# Altium schematic sheet Supplies.SchDoc
size A4; SheetNumber: 9; SheetTotal: 10; SPICEModelCacheEZLPWFQN: <root> / <DocumentId>EZLPWFQN</DocumentId> / <CacheFrame Number="0"> / <Model Name="1n4001" Kind="MDL"> / <Text>*1N4001 MCE 8-16-95 / *50V 1A Si GenPurpose Diode pkg:DIODE0.4 1,2 / .MODEL 1N4001 D(IS=2.55E-9 RS=0.042 N=1.75 TT=5.76E-6 CJO=1.85E-11 / + VJ=0.75 M=0.333 BV=50 IBV=1E-5 )</Text> / </Model> / </CacheFrame> / </root>
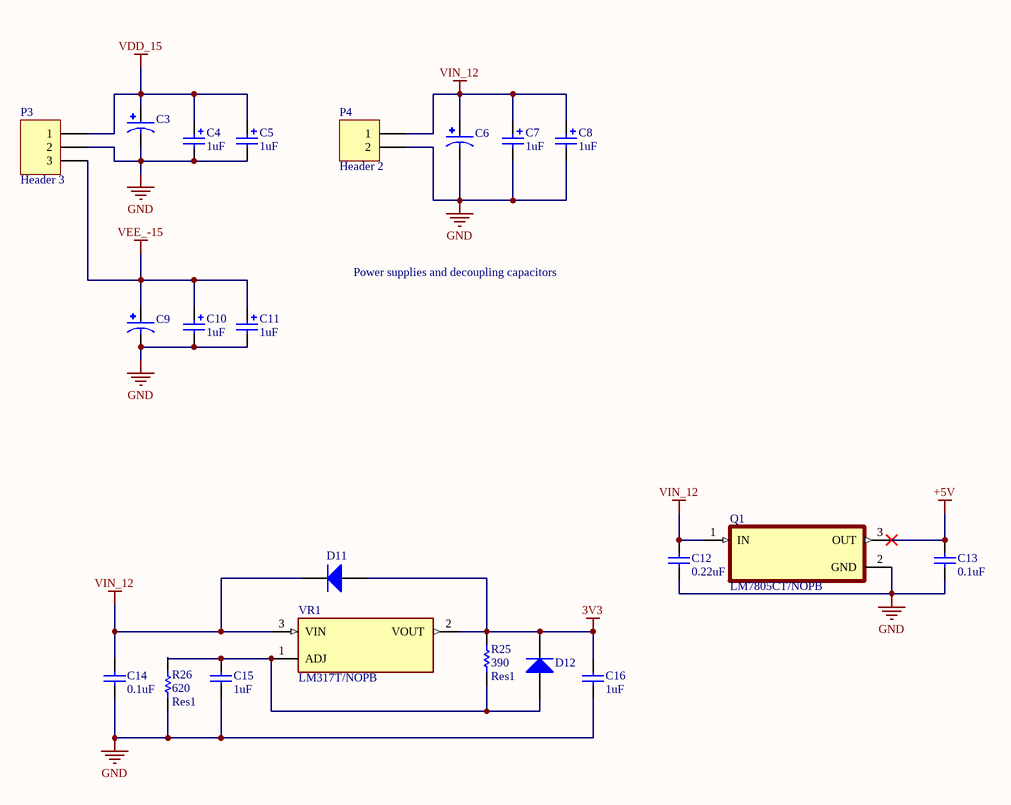
[diagram p0: Supplies.SchDoc]

## Parts
C3  ECA2AM100B  [CAPPRD500W50D500H1100]  (value not drawn)
C4  value 1uF  [RAD-0.1]  (hidden comment: Cap No Pol)
C5  value 1uF  [RAD-0.1]  (hidden comment: Cap No Pol)
C6  ECA2AM100B  [CAPPRD500W50D500H1100]  (value not drawn)
C7  value 1uF  [RAD-0.1]  (hidden comment: Cap No Pol)
C8  value 1uF  [RAD-0.1]  (hidden comment: Cap No Pol)
C9  ECA2AM100B  [CAPPRD500W50D500H1100]  (value not drawn)
C10  value 1uF  [RAD-0.1]  (hidden comment: Cap No Pol)
C11  value 1uF  [RAD-0.1]  (hidden comment: Cap No Pol)
C12  value 0.22uF  [RAD-0.3]  (hidden comment: Cap)
C13  value 0.1uF  [RAD-0.3]  (hidden comment: Cap)
C14  value 0.1uF  [RAD-0.3]  (hidden comment: Cap)
C15  value 1uF  [RAD-0.3]  (hidden comment: Cap)
C16  value 1uF  [RAD-0.3]  (hidden comment: Cap)
D11  Diode 1N4001  [DO-41]  (value not drawn)
D12  Diode 1N4001  [DO-41]  (value not drawn)
P3  Header 3  [HDR1X3]
P4  Header 2  [HDR1X2]
Q1  LM7805CT/NOPB  [TO254P1054X470X1955-3]
R25  Res1  value 390  [AXIAL-0.4]
R26  Res1  value 620  [AXIAL-0.4]
VR1  LM317T/NOPB  [TO254P1054X470X1955-3]

## Nets
3V3: C16.1 D11.1(A) D12.2(K) R25.2 VR1.2(VOUT)
+5V: C13.1 Q1.3(OUT)
GND: C3.N C4.2 C5.2 C6.N C7.2 C8.2 C9.N C10.2 C11.2 C12.2 C13.2 C14.2 C15.2 C16.2 P3.2 P4.2 Q1.2(GND) R26.1
VDD_15: C3.P C4.1 C5.1 P3.1
VEE_-15: C9.P C10.1 C11.1 P3.3
VIN_12: C6.P C7.1 C8.1 C12.1 C14.1 D11.2(K) P4.1 Q1.1(IN) VR1.3(VIN)
NetC15_1: C15.1 D12.1(A) R25.1 R26.2 VR1.1(ADJ)

## Notes on the sheet
- Power supplies and decoupling capacitors

## Library data of the parts
C3 C6 C9 = ECA2AM100B: 10ÂµF 100V Aluminum Electrolytic Capacitors Radial, Can 2000 Hrs @ 85Â°C; MF: Panasonic; Value: *; Package: RADIAL-2 Panasonic; Check_prices: https://www.snapeda.com/parts/ECA2AM100B/Panasonic/view-part/?ref=eda; SnapEDA_Link: https://www.snapeda.com/parts/ECA2AM100B/Panasonic/view-part/?ref=snap; MP: ECA2AM100B; Digi-Key_Part_Number: P19556TB-ND
C4 C5 C7 C8 C10 C11 = Cap No Pol: Polarized Capacitor (Radial); Published: 8-Jun-2000; LatestRevisionDate: 17-Jul-2002; LatestRevisionNote: Re-released for DXP Platform.; PackageReference: RB7.6-15; Publisher: Altium Limited; PackageDescription: Polarized Capacitor (Radial); 2 Leads
C12-C16 = Cap: Capacitor; Published: 8-Jun-2000; LatestRevisionDate: 17-Jul-2002; LatestRevisionNote: Re-released for DXP Platform.; PackageReference: RAD-0.3; Publisher: Altium Limited; PackageDescription: Radial Cap, Thru-Hole; 2 Leads; 0.3 in Pin Spacing
D11 D12 = Diode 1N4001: 1 Amp General Purpose Rectifier; Published: 8-Jun-2000; LatestRevisionDate: 17-Jul-2002; LatestRevisionNote: Re-released for DXP Platform.; DatasheetVersion: 1998; PackageVersion: Aug-1999; PackageReference: DO-41; Publisher: Altium Limited; PackageDescription: Diode, Axial; Body 5.2 x 2.7 mm (LxDia. max), Lead Dia. 0.86 mm (max); Code_JEDEC: DO-204-AL; ComponentLink1Description: Manufacturer Link; ComponentLink1URL: http://www.fairchildsemi.com/; ComponentLink2Description: Datasheet; ComponentLink2URL: http://www.fairchildsemi.com/ds/1N%2F1N4001.pdf
P3 = Header 3: Header, 3-Pin; LatestRevisionDate: 17-Jul-2002; LatestRevisionNote: Re-released for DXP Platform.; Publisher: Altium Limited
P4 = Header 2: Header, 2-Pin; LatestRevisionDate: 17-Jul-2002; LatestRevisionNote: Re-released for DXP Platform.; Publisher: Altium Limited
R25 R26 = Res1: Resistor; Published: 8-Jun-2000; LatestRevisionDate: 17-Jul-2002; LatestRevisionNote: Re-released for DXP Platform.; PackageReference: AXIAL-0.3; Publisher: Altium Limited; PackageDescription: Axial Device, Thru-Hole; 2 Leads; 0.3 in Pin Spacing
VR1 = LM317T/NOPB: 1.5-A, 40-V, adjustable linear voltage regulator; MF: Texas Instruments; SnapEDA_Link: https://www.snapeda.com/parts/LM317T/NOPB/Texas+Instruments/view-part/?ref=snap; Package: TO-220-3 Texas Instruments; Value: *; MP: LM317T/NOPB; Check_prices: https://www.snapeda.com/parts/LM317T/NOPB/Texas+Instruments/view-part/?ref=eda
Q1 = LM7805CT/NOPB: Price: None; MP: LM7805CT/NOPB; Availability: Unavailable; Value: *; Package: None